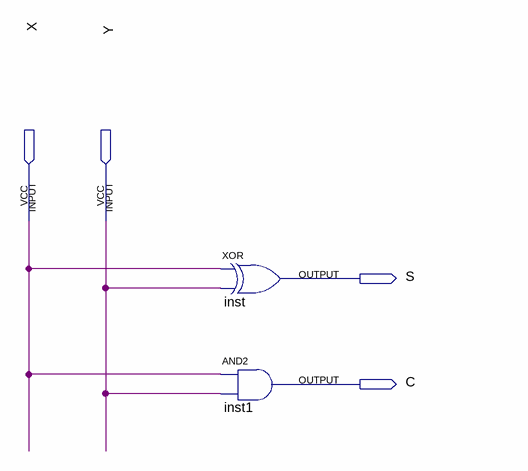
[diagram p0: schematic sheet]
// Quartus schematic HalfAdder.bdf as structural Verilog: 2 symbols, 4 pins
module HalfAdder (
  input  X,
  input  Y,
  output S,
  output C
);

  xor inst (S, X, Y);
  and inst1 (C, X, Y);
endmodule
